# Altium schematic sheet IF1001.SchDoc
size A3
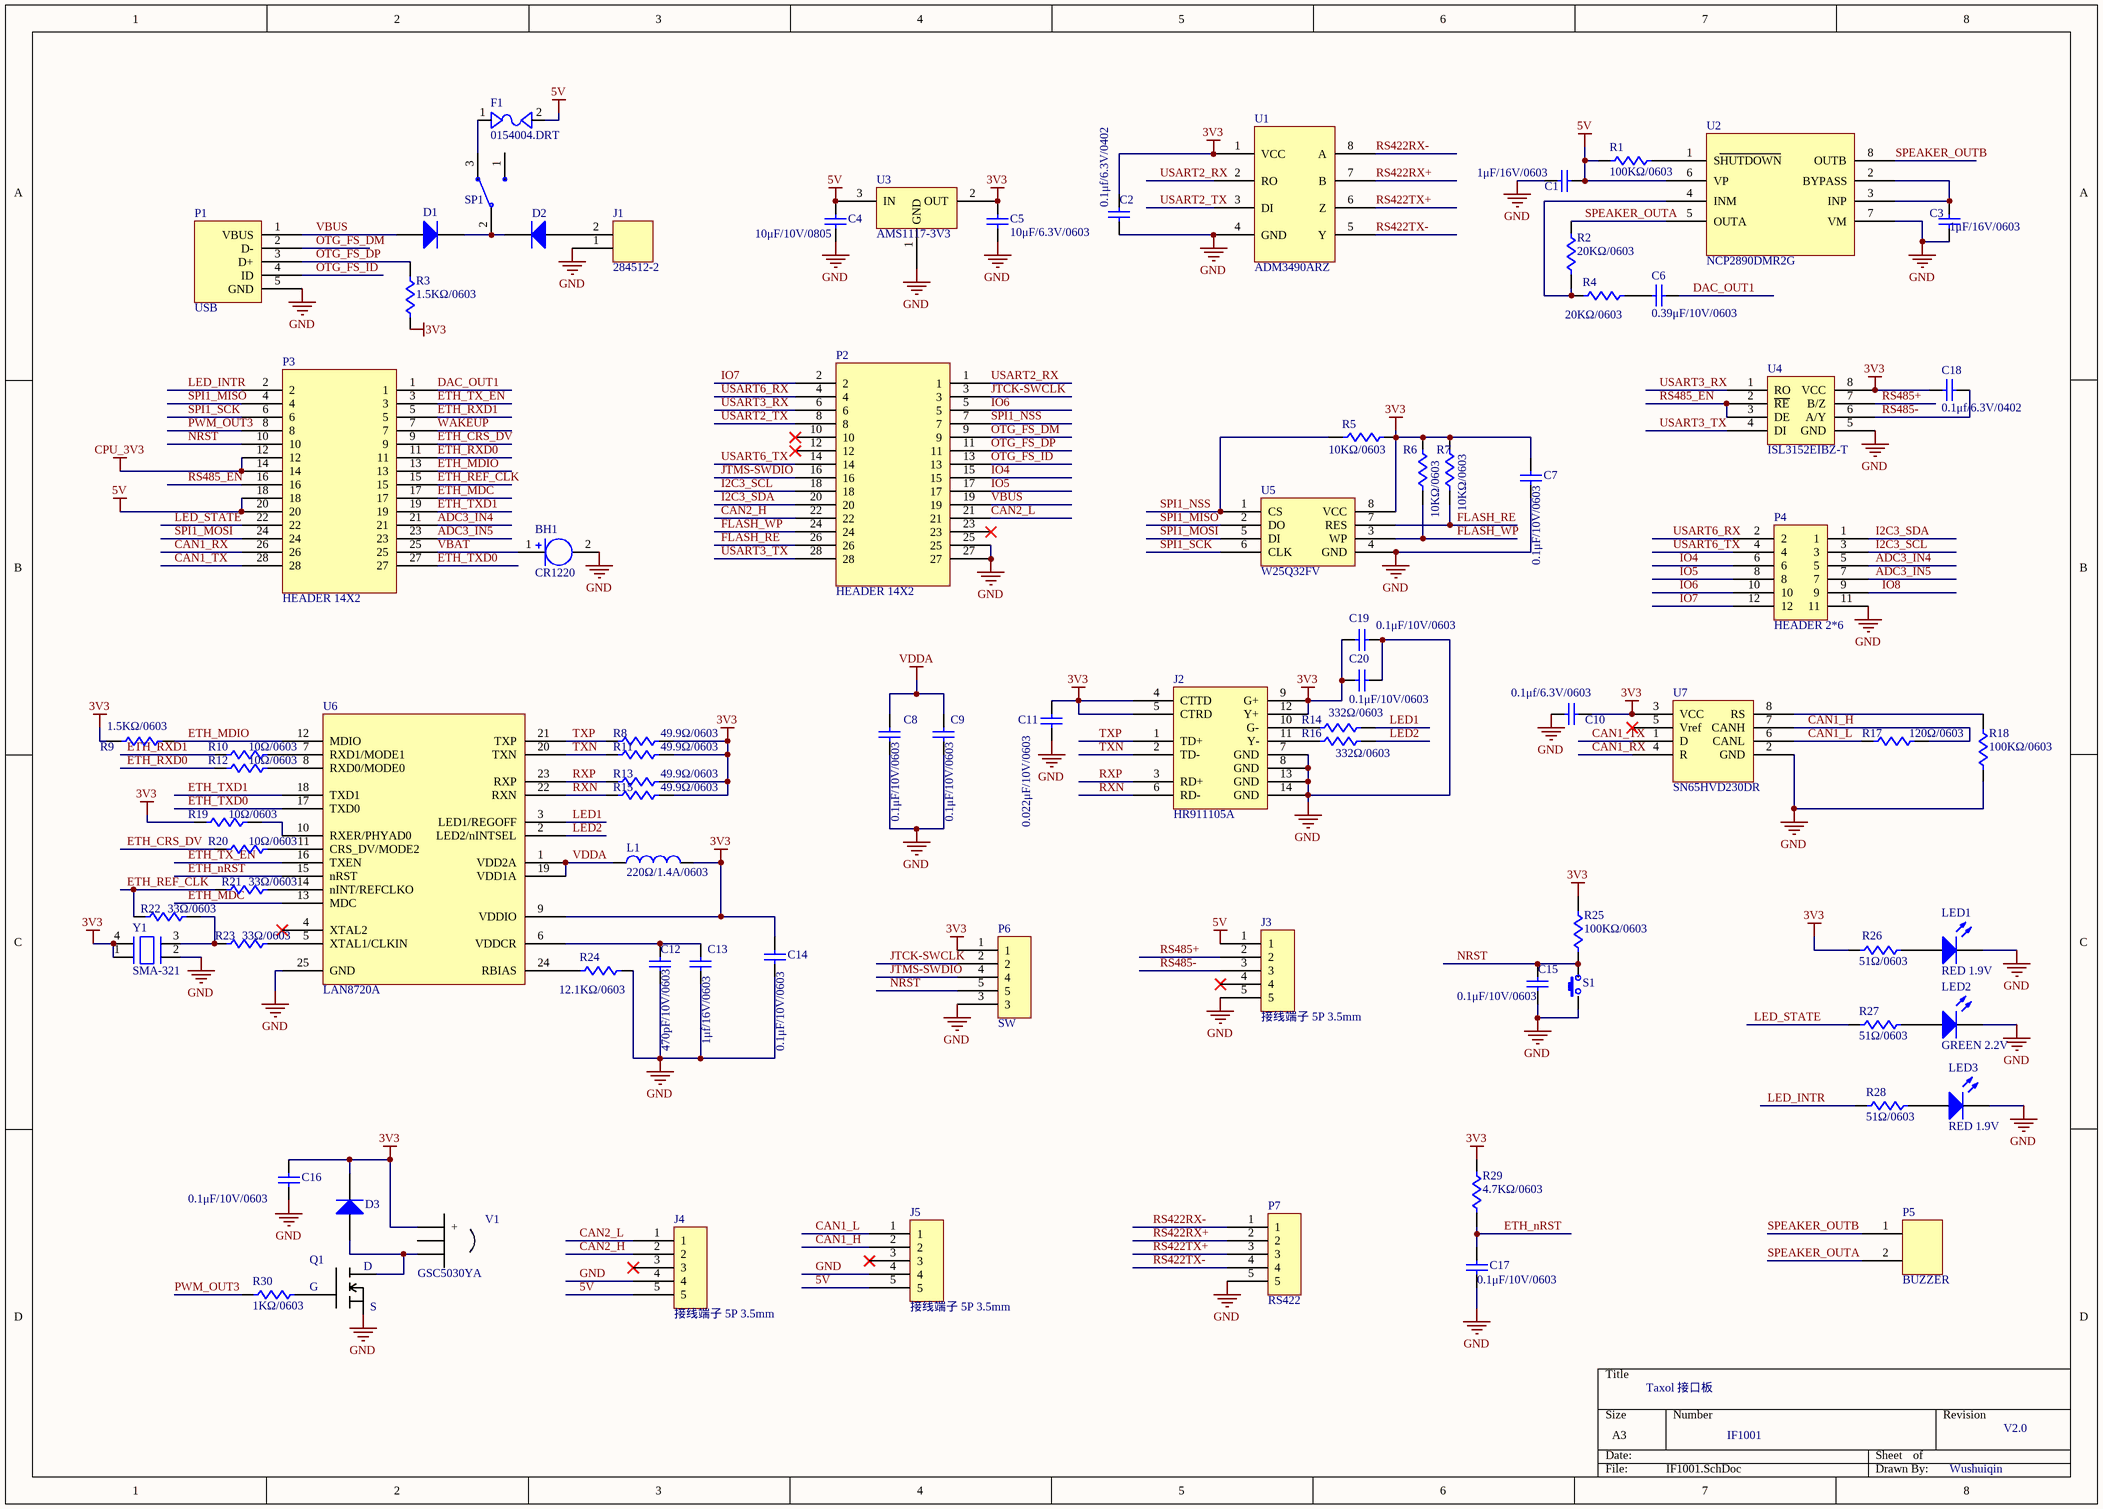
[diagram p0: IF1001.SchDoc]

## Parts
BH1  CR1220  [CR1220]
C1  1μF/16V/0603  [CAPACITOR_0603]
C2  0.1μf/6.3V/0402  [CAPACITOR_0402]
C3  1μF/16V/0603  [CAPACITOR_0603]
C4  10μF/10V/0805  [CAPACITOR_0805]
C5  10μF/6.3V/0603  [CAPACITOR_0603]
C6  0.39μF/10V/0603  [CAPACITOR_0603]
C7  0.1μF/10V/0603  [CAPACITOR_0603]
C8  0.1μF/10V/0603  [CAPACITOR_0603]
C9  0.1μF/10V/0603  [CAPACITOR_0603]
C10  0.1μf/6.3V/0603  [CAPACITOR_0603]
C11  0.022μF/10V/0603  [CAPACITOR_0603]
C12  470pF/10V/0603  [CAPACITOR_0603]
C13  1μf/16V/0603  [CAPACITOR_0603]
C14  0.1μF/10V/0603  [CAPACITOR_0603]
C15  0.1μF/10V/0603  [CAPACITOR_0603]
C16  0.1μF/10V/0603  [CAPACITOR_0603]
C17  0.1μF/10V/0603  [CAPACITOR_0603]
C18  0.1μf/6.3V/0402  [CAPACITOR_0402]
C19  0.1μF/10V/0603  [CAPACITOR_0603]
C20  0.1μF/10V/0603  [CAPACITOR_0603]
D1  BAT60JFILM  [BAT60JFILM]  (value not drawn)
D2  BAT60JFILM  [BAT60JFILM]  (value not drawn)
D3  PMEG2010AEB  [PMEG2010AEB_SOD523]  (value not drawn)
F1  0154004.DRT  [FUSE1808]
J1  284512-2  [284512-2]
J2  HR911105A  [HR911105A]
J3  接线端子 5P 3.5mm  [接线端子5P 3.5mm]
J4  接线端子 5P 3.5mm  [接线端子5P 3.5mm]
J5  接线端子 5P 3.5mm  [接线端子5P 3.5mm]
L1  220Ω/1.4A/0603  [LNDUCTOR 0603]
LED1  RED 1.9V  [LED]
LED2  GREEN 2.2V  [LED]
LED3  RED 1.9V  [LED]
P1  USB  [MINI_USB]
P2  HEADER 14X2  [PIN]
P3  HEADER 14X2  [PIN]
P4  HEADER 2*6  [HEADER 2*6]
P5  BUZZER  [HEADER 1*2]
P6  SW  [HEADER 1*5]
P7  RS422  [HEADER 1*5]
Q1  PMV185XN  [PMV185XN]  (value not drawn)
R1  100KΩ/0603  [RESSOSTANCE_0603]
R2  20KΩ/0603  [RESSOSTANCE_0603]
R3  1.5KΩ/0603  [RESSOSTANCE_0603]
R4  20KΩ/0603  [RESSOSTANCE_0603]
R5  10KΩ/0603  [RESSOSTANCE_0603]
R6  10KΩ/0603  [RESSOSTANCE_0603]
R7  10KΩ/0603  [RESSOSTANCE_0603]
R8  49.9Ω/0603  [RESSOSTANCE_0603]
R9  1.5KΩ/0603  [RESSOSTANCE_0603]
R10  10Ω/0603  [RESSOSTANCE_0603]
R11  49.9Ω/0603  [RESSOSTANCE_0603]
R12  10Ω/0603  [RESSOSTANCE_0603]
R13  49.9Ω/0603  [RESSOSTANCE_0603]
R14  332Ω/0603  [RESSOSTANCE_0603]
R15  49.9Ω/0603  [RESSOSTANCE_0603]
R16  332Ω/0603  [RESSOSTANCE_0603]
R17  120Ω/0603  [RESSOSTANCE_0603]
R18  100KΩ/0603  [RESSOSTANCE_0603]
R19  10Ω/0603  [RESSOSTANCE_0603]
R20  10Ω/0603  [RESSOSTANCE_0603]
R21  33Ω/0603  [RESSOSTANCE_0603]
R22  33Ω/0603  [RESSOSTANCE_0603]
R23  33Ω/0603  [RESSOSTANCE_0603]
R24  12.1KΩ/0603  [RESSOSTANCE_0603]
R25  100KΩ/0603  [RESSOSTANCE_0603]
R26  51Ω/0603  [RESSOSTANCE_0603]
R27  51Ω/0603  [RESSOSTANCE_0603]
R28  51Ω/0603  [RESSOSTANCE_0603]
R29  4.7KΩ/0603  [RESSOSTANCE_0603]
R30  1KΩ/0603  [RESSOSTANCE_0603]
S1  K2-1107ST  [SW-侧开]  (value not drawn)
SP1  2.00mm 3P SPDT  [SW-STDP]  (value not drawn)
U1  ADM3490ARZ  [ADM3490]
U2  NCP2890DMR2G  [NCP2890]
U3  AMS1117-3V3  [AMS1117-3V3]
U4  ISL3152EIBZ-T  [ISL3152EIBZ-T]
U5  W25Q32FV  [W25Q32FV]
U6  LAN8720A  [LAN8720A]
U7  SN65HVD230DR  [SN65HVD230]
V1  GSC5030YA  [GSC5030YA-12R4000]
Y1  SMA-321  [XO35]

## Nets
3V3: C2.2 C5.2 C7.2 C10.1 C11.2 C14.2 C16.2 C18.2 C19.2 C20.2 D3.2(K) J2.4(CTTD) J2.5(CTRD) J2.9(G+) J2.12(Y+) L1.2 P6.1 R3.1 R5.1 R6.1 R7.1 R8.2 R9.2 R11.2 R13.2 R15.2 R19.1 R25.2 R26.1 R29.1 U1.1(VCC) U3.2(OUT) U4.8(VCC) U5.8(VCC) U6.9(VDDIO) U7.3(VCC) V1.1(+) Y1.1 Y1.4
5V: C1.2 C4.2 F1.2(P2) J3.1 J4.5 J5.5 P3.18 P3.20 R1.1 U2.6(VP) U3.3(IN)
CPU_3V3: P3.12 P3.14
GND: BH1.2 C1.1 C2.1 C3.1 C4.1 C5.1 C7.1 C8.1 C9.1 C10.2 C11.1 C12.2 C13.2 C14.1 C15.1 C16.1 C17.1 C19.1 C20.1 J1.1 J2.7(GND) J2.8(GND) J2.13(GND) J2.14(GND) J3.5 J4.4 J5.4 LED1.2(K) LED2.2(K) LED3.2(K) P1.5(GND) P2.25 P2.27 P4.11 P6.3 P7.5 Q1.2(S) R18.1 R24.1 S1.1 U1.4(GND) U2.7(VM) U3.1(GND) U4.5(GND) U5.4(GND) U6.25(GND) U7.2(GND) Y1.2
VDDA: C8.2 C9.2 L1.1 U6.1(VDD2A) U6.19(VDD1A)
ADC3_IN4: P3.21 P4.5
ADC3_IN5: P3.23 P4.7
CAN1_H: J5.2 R17.2 U7.7(CANH)
CAN1_L: J5.1 R17.1 U7.6(CANL)
CAN1_RX: P3.26 U7.4(R)
CAN1_TX: P3.28 U7.1(D)
CAN2_H: J4.2 P2.22
CAN2_L: J4.1 P2.21
DAC_OUT1: C6.2 P3.1
ETH_CRS_DV: P3.9 R20.1
ETH_MDC: P3.17 U6.13(MDC)
ETH_MDIO: P3.13 R9.1 U6.12(MDIO)
ETH_nRST: C17.2 R29.2 U6.15(nRST)
ETH_REF_CLK: P3.15 R21.1 R22.1
ETH_RXD0: P3.11 R12.1
ETH_RXD1: P3.5 R10.1
ETH_TX_EN: P3.3 U6.16(TXEN)
ETH_TXD0: P3.27 U6.17(TXD0)
ETH_TXD1: P3.19 U6.18(TXD1)
FLASH_RE: P2.26 R7.2 U5.7(RES)
FLASH_WP: P2.24 R6.2 U5.3(WP)
I2C3_SCL: P2.18 P4.3
I2C3_SDA: P2.20 P4.1
IO4: P2.15 P4.6
IO5: P2.17 P4.8
IO6: P2.5 P4.10
IO7: P2.2 P4.12
IO8: P4.9
JTCK-SWCLK: P2.3 P6.2
JTMS-SWDIO: P2.16 P6.4
LED1: R14.2 U6.3(LED1/REGOFF)
LED2: R16.2 U6.2(LED2/nINTSEL)
LED_INTR: P3.2 R28.1
LED_STATE: P3.22 R27.1
NRST: C15.2 P3.10 P6.5 R25.1 S1.2
OTG_FS_DM: P1.2(D-) P2.9
OTG_FS_DP: P1.3(D+) P2.11 R3.2
OTG_FS_ID: P1.4(ID) P2.13
PWM_OUT3: P3.8 R30.1
RS422RX+: P7.2 U1.7(B)
RS422RX-: P7.1 U1.8(A)
RS422TX+: P7.3 U1.6(Z)
RS422TX-: P7.4 U1.5(Y)
RS485+: J3.2 U4.7(B/Z)
RS485-: C18.1 J3.3 U4.6(A/Y)
RS485_EN: P3.16 U4.2(~{RE}) U4.3(DE)
RXN: J2.6(RD-) R15.1 U6.22(RXN)
RXP: J2.3(RD+) R13.1 U6.23(RXP)
SPEAKER_OUTA: P5.2 R2.1 U2.5(OUTA)
SPEAKER_OUTB: P5.1 U2.8(OUTB)
SPI1_MISO: P3.4 U5.2(DO)
SPI1_MOSI: P3.24 U5.5(DI)
SPI1_NSS: P2.7 R5.2 U5.1(CS)
SPI1_SCK: P3.6 U5.6(CLK)
TXN: J2.2(TD-) R11.1 U6.20(TXN)
TXP: J2.1(TD+) R8.1 U6.21(TXP)
USART2_RX: P2.1 U1.2(RO)
USART2_TX: P2.8 U1.3(DI)
USART3_RX: P2.6 U4.1(RO)
USART3_TX: P2.28 U4.4(DI)
USART6_RX: P2.4 P4.2
USART6_TX: P2.14 P4.4
VBAT: BH1.1 P3.25
VBUS: D1.1(A) P1.1(VBUS) P2.19
WAKEUP: P3.7
NetC3_2: C3.2 U2.2(BYPASS) U2.3(INP)
NetC6_1: C6.1 R4.2
NetC12_1: C12.1 C13.1 U6.6(VDDCR)
NetD1_2: D1.2(K) D2.2(K) SP1.2
NetD2_1: D2.1(A) J1.2
NetD3_1: D3.1(A) Q1.3(D) V1.2
NetF1_1: F1.1(P1) SP1.3
NetJ2_10: J2.10(G-) R14.1
NetJ2_11: J2.11(Y-) R16.1
NetLED1_1: LED1.1(A) R26.2
NetLED2_1: LED2.1(A) R27.2
NetLED3_1: LED3.1(A) R28.2
NetQ1_1: Q1.1(G) R30.2
NetR1_2: R1.2 U2.1(SHUTDOWN)
NetR2_2: R2.2 R4.1 U2.4(INM)
NetR10_2: R10.2 U6.7(RXD1/MODE1)
NetR12_2: R12.2 U6.8(RXD0/MODE0)
NetR18_2: R18.2 U7.8(RS)
NetR19_2: R19.2 U6.10(RXER/PHYAD0)
NetR20_2: R20.2 U6.11(CRS_DV/MODE2)
NetR21_2: R21.2 U6.14(nINT/REFCLKO)
NetR22_2: R22.2 R23.1 Y1.3
NetR23_2: R23.2 U6.5(XTAL1/CLKIN)
NetR24_2: R24.2 U6.24(RBIAS)

Not connected (* = marked no-connect by the designer): J3 4*; J4 3*; J5 3*; P2 10* 12* 23*; SP1 1; U6 4(XTAL2)*; U7 5(Vref)*; V1 3(NC)

## Notes on the sheet
- Taxol 接口板
- IF1001
- V2.0
- Wushuiqin
- (in symbol NCP2890DMR2G) Text

## Library data of the parts
BH1 = CR1220电池座: Manufacturer: 深圳市吉特雅电子有限公司; Value: 1220 3V 2引脚; Model: CR1220
C1 C3 C13 = CAPACITOR_0603: Manufacturer: TDK; Model: C1608X7R1C105K080AC
  C1 C3: Value: 1μF/16V/0603
  C13: Value: 1μf/16V/0603
C2 C18 = CAPACITOR_0603: Manufacturer: TDK; Model: C1005X5R0J104K050BA; Value: 0.1μf/6.3V/0402
C4 = CAP0805 UP: 陶瓷电容; Manufacturer: TDK; Model: C2012JB1A106K085AC; Value: 10μF/10V/0805
C5 = CAP0603 UP: 陶瓷电容; Manufacturer: TDK; Model: C1608JB0J106K080AB; Value: 10μF/6.3V/0603
C6 = CAPACITOR_0603: Manufacturer: kemet; Model: C0603C394K8PACTU; Value: 0.39μF/10V/0603
C7-C9 C14-C17 C19 C20 = CAPACITOR_0603: Manufacturer: Vishay; Model: VJ0603V104ZXQPW1BC; Value: 0.1μF/10V/0603
C10 = CAPACITOR_0603: Manufacturer: TDK; Model: C1608X7R1E104K080AA; Value: 0.1μf/6.3V/0603
C11 = CAPACITOR_0603: Manufacturer: Vishay; Model: VJ0603Y223JXQCW1BC; Value: 0.022μF/10V/0603
C12 = CAPACITOR_0603: Manufacturer: Vishay; Model: VJ0603A471KXQPW1BC; Value: 470pF/10V/0603
D1 D2 = BAT60JFILM: Manufacturer: ST; Value: 10V 3A; Model: BAT60JFILM
D3 = PMEG2010AEB: Manufacturer: NXP; Value: 0.62 V/1A; Model: PMEG2010AEB
F1 = F_4A: 保险丝; Manufacturer: Littlefuse; Value: 4A SMT 125V; Model: 0154004.DRT
J1 = 接线端子 2P 3.5mm: 间距3.5mm; Manufacturer: TE; Value: 11A/300V,间距3.5mm; Model: 284512-2
J2 = HR911105A: Manufacturer: 深圳市诚亨泰科技有限公司; Value: 12P; Model: HR911105A
J3-J5 = 接线端子 5P 3.5mm: Manufacturer: KEFA; Value: 3.5mm 5P; Model: KF2EDGV-3.5
L1 = BLM18PG221SN1D: 磁珠; Manufacturer: Murata; Value: 220Ω/1.4A/0603; Model: BLM18PG221SN1D
LED1 LED3 = LED: LED_G; Manufacturer: OSRAM; Model: LS Q971-KN-1; Value: RED 1.9V
LED2 = LED: LED_G; Manufacturer: OSRAM; Model: LG Q971-KN-1; Value: GREEN 2.2V
P1 = Mini_USB: Manufacturer: JAE; Model: UX60SC-MB-5ST(80); Value: Micro USB
P2 P3 = PIN_1: Model: 2*14P; Value: 2*14P/2mm/Double pin
P4 = HEADER 2*6: Value: 2.54mm 2*6P; Manufacture: *; Model: *
P5 = HEADER 1*2: Value: 2.54mm 2P Signal Straight; Manufacturer: *; Model: *
P6 = SW: Value: 2.54mm 5P Signal Straight; Manufacturer: *; Model: *
P7 = HEADER 1*5: Value: 2.54mm 5P Signal Straight; Manufacturer: *; Model: *
Q1 = MOSFET: Manufacturer: NXP; Value: 30V 1.2A; Model: PMV185XN
R1 R18 R25 = RESISTANCE: Manufacturer: VISHAY; Model: CRCW0603100KFKEA; Value: 100KΩ/0603
R2 R4 = RESISTANCE: Manufacturer: VISHAY; Model: CRCW060320K0FKEA; Value: 20KΩ/0603
R3 R9 = RESISTANCE: Manufacturer: VISHAY; Model: CRCW06031K50FKEA; Value: 1.5KΩ/0603
R5-R7 = RESISTANCE: Manufacturer: KOA Speer; Model: RK73H1JTTD1002F; Value: 10KΩ/0603
R8 R11 R13 R15 = RESISTANCE: Manufacturer: Vishay; Model: CRCW060349R9FKEA; Value: 49.9Ω/0603
R10 R12 R19 R20 = RESISTANCE: Manufacturer: Vishay; Model: CRCW060310R0FKEA; Value: 10Ω/0603
R14 R16 = RESISTANCE: Manufacturer: Vishay; Model: CRCW0603332RFKEB; Value: 332Ω/0603
R17 = RESISTANCE: Manufacturer: Vishay; Model: CRCW0603120RFKEA; Value: 120Ω/0603
R21-R23 = RESISTANCE: Manufacturer: Vishay; Model: CRCW060333R0FKEA; Value: 33Ω/0603
R24 = RESISTANCE: Manufacturer: Vishay; Model: CRCW060312K1FKEA; Value: 12.1KΩ/0603
R26-R28 = RESISTANCE: Manufacturer: Vishay; Model: TNPW060351R0BEEA; Value: 51Ω/0603
R29 = RESISTANCE: Manufacturer: Vishay; Model: CRCW06034K70FKEA; Value: 4.7KΩ/0603
R30 = RESISTANCE: Manufacturer: VISHAY; Model: CRCW04021K00FKED; Value: 1KΩ/0603
S1 = SW_PB: Manufacturer: 韩荣; Value: 6*3 2P; Model: K2-1107ST
SP1 = SW_STDP: Model: SK12D07VG; Value: 2.00mm 3P SPDT
U1 = ADM3490ARZ: RS422; Manufacturer: ANALOG DEVICES; Value: 3.3V RS-485/RS-422; Model: ADM3490ARZ
U2 = NCP2890DMR2G: AUDIO; Manufacturer: ON; Value: 1.08W,3/5V; Model: NCP2890DMR2G
U3 = AMS1117-3V3: 3V3稳压芯片; Manufacturer: Advanced Monolithic Systems; Value: 输出3.3V,10mA; Model: AMS1117-3V3
U4 = ISL3152EIBZ-T: RS485接口芯片; Manufacturer: INTERSIL; Value: RS485; Model: ISL3152EIBZ-T
U5 = W25Q32FV: Manufacturer: 华邦电子; Value: 32MBit; Model: W25Q32FV
U6 = LAN8720A: Manufacturer: SMSC; Value: 24-pin QFN 10/100M; Model: LAN8720A
U7 = SN65HVD230DR: CAN; Manufacturer: TEXAS INSTRUMENTS; Value: 3.3V CAN; Model: SN65HVD230DR
V1 = BUZZER: Manufacturer: INGHAI; Value: 5030 3V  4000HZ; Model: GSC5030YA
Y1 = SMA-321: 有源晶振; Manufacturer: AKER; Value: 50MHz/3225; Model: SMA-321